# EasyEDA Pro project EasyEDA_MEMS_FPC_V12.epro

# Schematic Schematic1
Assembly Variant: Basic; Board Name: Board1; Create Date: 2026-06-03; Page Name: P1; Project Name: ProDoc_Board1_2026-06-03; Schematic Name: Schematic1; Update Date: 2026-06-04; Company: 嘉立创EDA; Page Size: A4; Version: V1.0
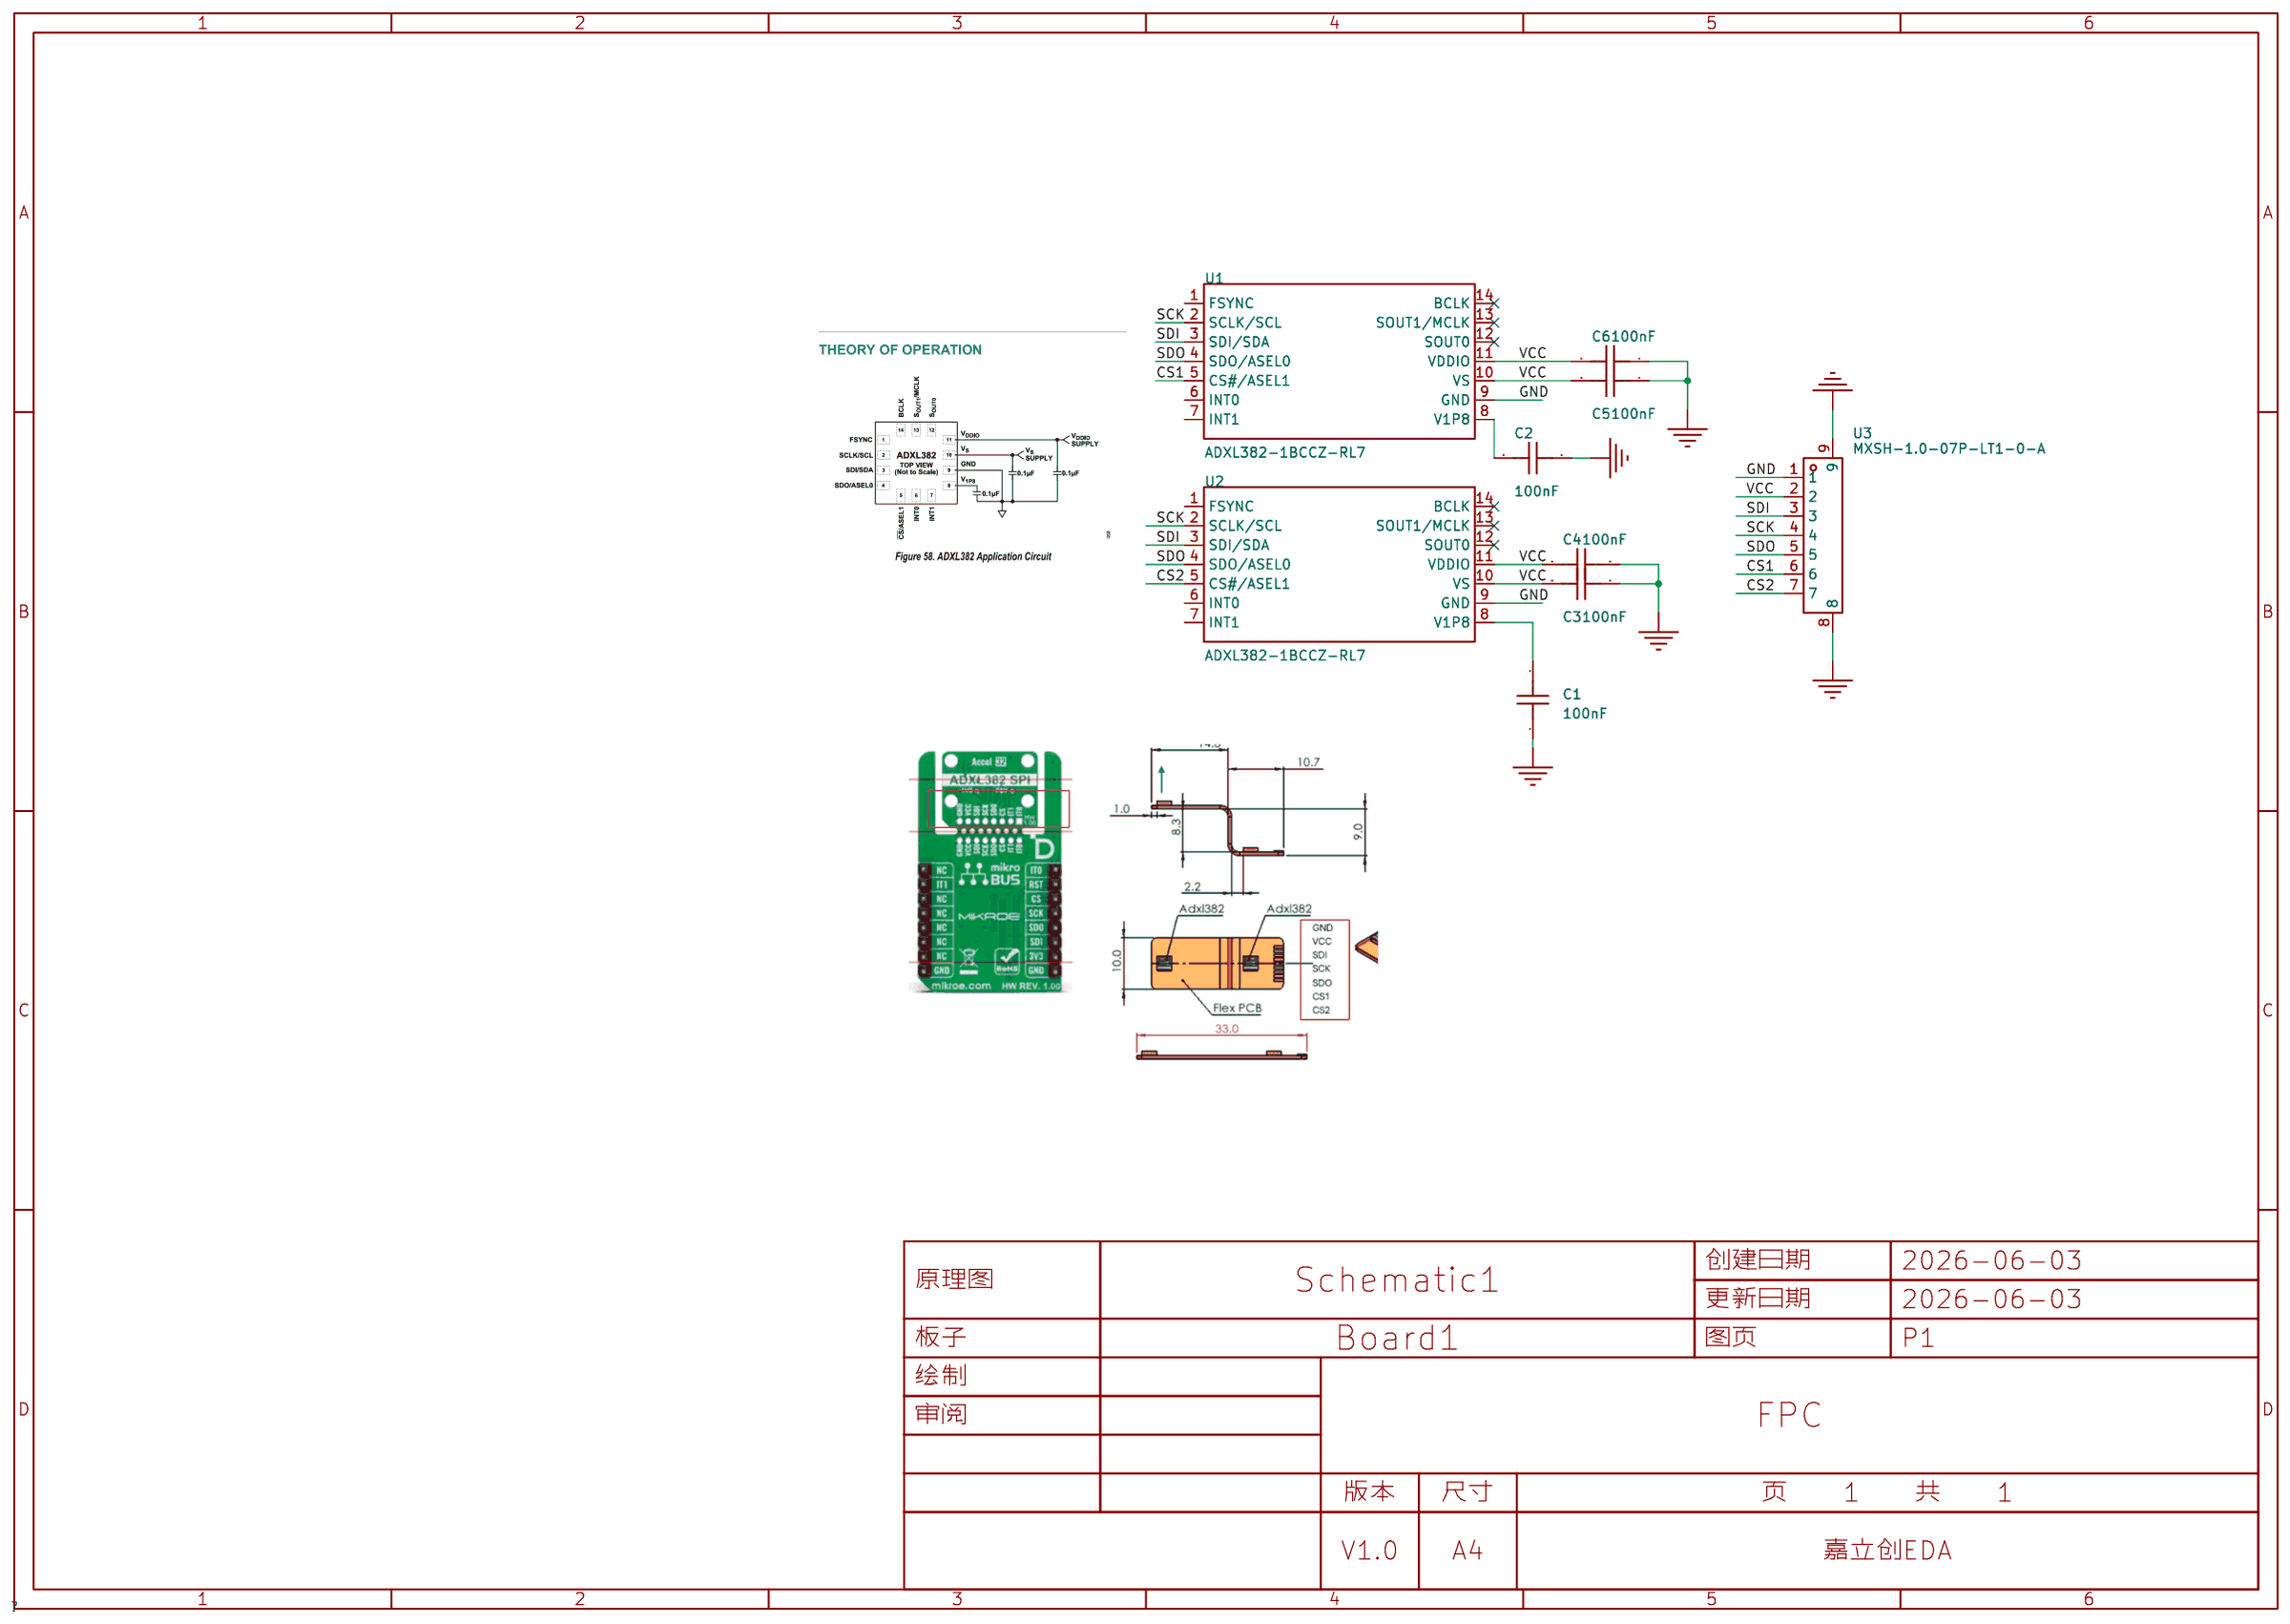
[diagram p0: schematic sheet]

## Parts
C1  100nF  [C0402]
C2  100nF  [C0402]
C3  100nF  [C0402]
C4  100nF  [C0402]
C5  100nF  [C0402]
C6  100nF  [C0402]
U1  ADXL382-1BCCZ-RL7  [LGA-14_L2.9-W2.8-P0.50-TL_CC-14-3]
U2  ADXL382-1BCCZ-RL7  [LGA-14_L2.9-W2.8-P0.50-TL_CC-14-3]
U3  MXSH-1.0-07P-LT1-0-A  [CONN-SMD_7P-P1.00_MAX_MXSH-1.0-07P-LT1-0-A]

## Library data of the parts
C1-C6 = CL05B104KO5NNNC: LCSC Part Name: 100nF ±10% 16V; Supplier Part: C1525; Manufacturer: SAMSUNG(三星); Supplier Footprint: 0402; JLCPCB Part Class: Basic Part; Datasheet: https://item.szlcsc.com/datasheet/CL05B104KO5NNNC/1877.html; Supplier: LCSC; Tolerance: ±10%; Voltage Rating: 16V; Temperature Coefficient: X7R
U1 U2 = ADXL382-1BCCZ-RL7_C41718413: LCSC Part Name: 低噪声、低功耗、宽带宽三轴MEMS加速度计，具备多协议接口和系统级节能特性; Supplier Part: C41718413; Manufacturer: ADI(亚德诺); Supplier Footprint: LGA-14; JLCPCB Part Class: Extended Part; Datasheet: https://item.szlcsc.com/datasheet/ADXL382-1BCCZ-RL7/43588120.html; Supplier: LCSC; Accelerometer Sensing Axis: X,Y,Z; Acceleration Measurement Range (MAX): ±60g; Sensor Type: 加速度计; Output Bits: 16bit; Interface: SPI; Voltage - Supply: 2.25V~3.6V; Cache Size: 0.64KB; Standby Current: 6.8uA; Operating Temperature: -40℃~+125℃; Features: 运动事件检测；过量程保护功能
U3 = MXSH-1.0-07P-LT1-0-A: LCSC Part Name: 1x7P 间距:1mm 立贴 系列:SH; Supplier Part: C19185719; Manufacturer: MAX(迈旭); Supplier Footprint: SMD,P=1mm; JLCPCB Part Class: Extended Part; Datasheet: https://item.szlcsc.com/datasheet/MXSH-1.0-07P-LT1-0-A/20402428.html; Supplier: LCSC; Pins Structure: 1x7P; Pitch: 1mm; Mounting Type: 立贴; Reference Series: SH; Number of Pins: 7P; Number of Rows: 1; Number of PINs Per Row: 7; Contact Plating: 锡; Operating Temperature: -25℃~+85℃; Voltage Rating: 150V; Plastic Material: LCP; Flame Retardant Rating: UL94V-0

## Nets
GND: C1.1 C2.1 C3.1 C4.1 C5.1 C6.1 U1.9(GND) U2.9(GND) U3.1 U3.8 U3.9
VCC: C3.2 C4.2 C5.2 C6.2 U1.10(VS) U1.11(VDDIO) U2.10(VS) U2.11(VDDIO) U3.2
CS1: U1.5(CS#/ASEL1) U3.6
CS2: U2.5(CS#/ASEL1) U3.7
SCK: U1.2(SCLK/SCL) U2.2(SCLK/SCL) U3.4
SDI: U1.3(SDI/SDA) U2.3(SDI/SDA) U3.3
SDO: U1.4(SDO/ASEL0) U2.4(SDO/ASEL0) U3.5
$1N26: C2.2 U1.8(V1P8)
$1N27: C1.2 U2.8(V1P8)

Not connected (* = marked no-connect by the designer): U1 1(FSYNC) 6(INT0) 7(INT1) 12(SOUT0)* 13(SOUT1/MCLK)* 14(BCLK)*; U2 1(FSYNC) 6(INT0) 7(INT1) 12(SOUT0)* 13(SOUT1/MCLK)* 14(BCLK)*

# Board PCB1
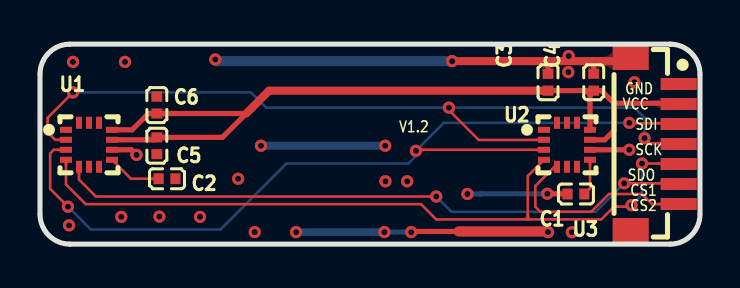
[diagram p1: board, top side]
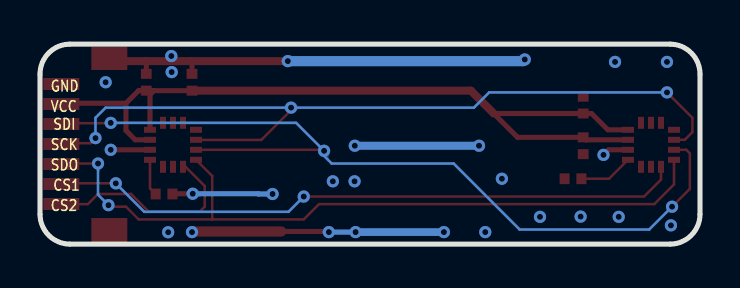
[diagram p2: board, bottom side, seen from below]

Outline 33 x 10 mm; copper layers: Top Layer, Bottom Layer. Coordinates in mm from the lower left corner of the outline.
Outline path: 0,8.5 0,1.5 arc(0.44,0.44) 1.5,0 31.5,0 arc(32.56,0.44) 33,1.5 33,8.5 arc(32.56,9.56) 31.5,10 1.5,10 arc(0.44,9.56) 0,8.5
Stack: Top Layer 0.012mm / Dielectric1 0.025mm FR4 er 4.5 / Bottom Layer 0.012mm

## Design rules (mm)
spacing copperThickness1oz (default): track to track 0.102, other pairs 0.076 to 0.3
spacing copperThickness2oz: track to track 0.203, other pairs 0.152 to 0.3
spacing Plane_innerPlane: track to track 0.102, other pairs 0.076 to 0.3
spacing Copper_copperRegion: track to track 0.102, other pairs 0.076 to 0.3
track width copperThickness1oz (default): min 0.127, default 0.254, max 2.54
track width copperThickness2oz: min 0.203, default 0.254, max 2.54
differential pair differentialPair (default): width min 0.127, default 0.254, max 2.54; gap min 0.152, default 0.152
via viaSize (default): diameter min 0.4, default 0.4, max 10; hole min 0.3, default 0.3, max 6.3
pour e155 uses Copper_copperRegion
pour e160 uses Copper_copperRegion
pour e194 uses Copper_copperRegion

## Placement (name value [footprint] x y rotation side)
C1  100nF  [C0402]  26.8 2.51 0 top
C2  100nF  [C0402]  6.35 3.27 180 top
C3  100nF  [C0402]  25.4 8.09 270 top
C4  100nF  [C0402]  27.69 8.09 270 top
C5  100nF  [C0402]  5.84 4.92 90 top
C6  100nF  [C0402]  5.84 6.95 270 top
U1  ADXL382-1BCCZ-RL7  [LGA-14_L2.9-W2.8-P0.50-TL_CC-14-3]  2.45 4.97 0 top
U2  ADXL382-1BCCZ-RL7  [LGA-14_L2.9-W2.8-P0.50-TL_CC-14-3]  26.35 4.97 0 top
U3  MXSH-1.0-07P-LT1-0-A  [CONN-SMD_7P-P1.00_MAX_MXSH-1.0-07P-LT1-0-A]  30.73 5.01 270 top

## Footprints (pads in the part's own frame, mm; a bottom-side part is the same pattern mirrored in y, then rotated)
C0402
  rect 0.5x0.54 smd: 1(-0.42,0) 2(0.42,0)
CONN-SMD_7P-P1.00_MAX_MXSH-1.0-07P-LT1-0-A
  rect 0.6x1.8 smd: 1(-3,1.2) 2(-2,1.2) 3(-1,1.2) 4(0,1.2) 5(1,1.2) 6(2,1.2) 7(3,1.2)
  rect 1.2x1.8 smd: 8(4.3,-1.2) 9(-4.3,-1.2)
LGA-14_L2.9-W2.8-P0.50-TL_CC-14-3
  rect 0.6x0.3 smd: 1(-1.15,0.75) 2(-1.15,0.25) 3(-1.15,-0.25) 4(-1.15,-0.75) 8(1.15,-0.75) 9(1.15,-0.25) 10(1.15,0.25) 11(1.15,0.75)
  rect 0.3x0.6 smd: 5(-0.5,-1.1) 6(0,-1.1) 7(0.5,-1.1) 12(0.5,1.1) 13(0,1.1) 14(-0.5,1.1)

## Nets
As in the schematic.

Pads without a net: U1 1 6 7 12 13 14; U2 1 6 7 12 13 14

## Via types
v1: diameter 0.61, hole 0.305, Top Layer to Bottom Layer, 36 vias

## Routing (per net, layer and track width the routed paths; a pad name or vN(x,y) marks a point on that pad's centre or on a via; arc(x,y) is an arc through that point)
GND: length 49.3
  Top Layer w0.254: v1(25.36,2.52) 26.36,2.52 C1.1 ; 27.69,9.15 27.69,9.15 C4.1 ; 25.44,9.15 25.4,9.11 C3.1 ; v1(4.83,4.46) 4.57,4.72 U1.9 ; v1(18.56,0.6) 18.59,0.63 20.94,0.63 ; U2.9 v1(29.46,4.72)
  Top Layer w0.4: U3.9 29.38,9.15 v1(20.61,9.15)
  Top Layer w0.508: v1(25.4,0.6) 25.37,0.63 20.94,0.63
  Bottom Layer w0.254: v1(21.37,2.51) 22.07,2.51 22.09,2.52 v1(25.36,2.52) ; v1(17.22,0.6) v1(18.56,0.6)
  Bottom Layer w0.381: 12.83,0.6 v1(17.22,0.6)
  Bottom Layer w0.4: v1(11.05,4.92) v1(17.26,4.92)
  Bottom Layer w0.508: v1(20.61,9.15) 8.85,9.15 v1(8.76,9.23)
  vias: v1(1.45,0.94) v1(1.65,9.11) v1(4.06,1.36) v1(4.25,9.11) v1(5.97,1.38) v1(8,1.36) v1(9.91,3.27) v1(10.74,0.6) v1(12.81,0.6) v1(17.27,3.14) v1(18.36,3.14) v1(26.44,9.41) v1(26.42,8.6) v1(26.59,0.59) v1(29.72,8.09)
VCC: length 42.1
  Top Layer w0.254: 27.31,7.67 27.5,7.48 U2.11 ; 27.31,7.67 C3.2 ; 27.31,7.67 C4.2 28.07,7.67 28.7,7.04 ; U2.10 28.24,5.22 28.7,5.68 28.7,7.04 ; 28.7,7.04 32.58,7.04 ; U1.11 4.61,5.72 5.42,6.53 C6.2 10.31,6.53 9.12,5.34 C5.2 5.72,5.22 U1.10
  Top Layer w0.4: 10.31,6.53 11.46,7.67 C3.2
CS1: length 31.9
  Top Layer w0.127: U1.5 1.95,3.22 2.79,2.38 v1(19.81,2.38) ; 31.93,2.92 31.87,2.92 31.75,3.04 v1(29.21,3.04)
  Bottom Layer w0.127: v1(29.21,3.04) 27.79,1.62 20.57,1.62 v1(19.81,2.38)
CS2: length 10.4
  Top Layer w0.127: U2.5 25.72,3.87 24.76,2.91 24.76,1.87 25.02,1.62 27.56,1.62 28.45,2.51 30.1,2.51 30.61,2 31.76,2 31.81,2.05 31.93,2.05
SCK: length 41
  Top Layer w0.127: v1(30.23,5.3) 30.48,5.05 31.93,5.05 ; v1(20.45,6.83) 20.45,6.7 21.94,5.21 25.07,5.21 25.07,5.22 U2.2 ; v1(1.65,7.59) 0.38,6.32 0.38,5.6 0.76,5.22 U1.2
  Bottom Layer w0.127: v1(1.65,7.59) 10.54,7.59 11.3,6.83 v1(20.45,6.83) 29.72,6.83 30.23,6.32 v1(30.23,5.3)
SDI: length 43.7
  Top Layer w0.127: U2.3 18.85,4.72 v1(18.8,4.67) ; v1(1.4,1.87) 0.51,2.76 0.51,4.54 0.69,4.72 1.3,4.72 ; v1(29.46,6.06) 29.48,6.05 31.93,6.05
  Bottom Layer w0.127: v1(29.46,6.06) 20.19,6.06 v1(18.8,4.67) 18.8,4.41 18.41,4.03 12.32,4.03 9.02,0.73 2.54,0.73 v1(1.4,1.87)
SDO: length 38
  Top Layer w0.127: 24.39,1.24 28.07,1.24 28.7,1.87 29.5,1.87 v1(29.58,1.95) ; 24.39,1.24 24.39,3.41 U2.4 ; 24.39,1.24 19.81,1.24 19.05,2 2.29,2 1.3,2.98 U1.4 ; 31.93,4.05 31.92,4.03 v1(30.1,4.03)
  Bottom Layer w0.127: v1(29.58,1.95) 30.1,2.47 v1(30.1,4.03)
$1N26: length 2.7
  Top Layer w0.127: C2.2 4.55,3.27 U1.8
$1N27: length 1.8
  Top Layer w0.127: C1.2 27.5,2.79 U2.8

## Copper pours and planes (outline as drawn; the poured copper is in the pictures)
GND on Top Layer: 14.73,9.87 22.39,9.87 22.39,0.13 14.73,0.13
GND on Top Layer: 0.38,8.25 0.39,8.43 0.44,8.67 0.53,8.9 0.66,9.12 0.82,9.31 1.01,9.47 1.22,9.59 1.45,9.68 1.7,9.73 1.88,9.75 31.14,9.75 31.32,9.73 31.57,9.68 31.8,9.59 32.01,9.47 32.2,9.31 32.36,9.12 32.49,8.9 32.58,8.67 32.63,8.43 32.64,8.25 32.64,1.72 32.63,1.54 32.58,1.29 32.49,1.06 32.36,0.85 32.2,0.66 32.01,0.5 31.8,0.37 31.57,0.28 31.32,0.23 31.14,0.22 1.88,0.22 1.7,0.23 1.45,0.28 1.22,0.37 1.01,0.5 0.82,0.66 0.66,0.85 0.53,1.06 0.44,1.29 0.39,1.54 0.38,1.72
GND on Bottom Layer: 0.38,8.25 0.39,8.43 0.44,8.67 0.53,8.9 0.66,9.12 0.82,9.31 1.01,9.47 1.22,9.59 1.45,9.68 1.7,9.73 1.88,9.75 31.27,9.75 31.45,9.73 31.69,9.68 31.92,9.59 32.14,9.47 32.33,9.31 32.49,9.12 32.61,8.9 32.7,8.67 32.75,8.43 32.77,8.25 32.77,1.72 32.75,1.54 32.7,1.29 32.61,1.06 32.49,0.85 32.33,0.66 32.14,0.5 31.92,0.37 31.69,0.28 31.45,0.23 31.27,0.22 1.88,0.22 1.7,0.23 1.45,0.28 1.22,0.37 1.01,0.5 0.82,0.66 0.66,0.85 0.53,1.06 0.44,1.29 0.39,1.54 0.38,1.72

Small or netless copper shapes (teardrops, artwork), in the pictures only: 49 on Top Layer, 16 on Bottom Layer

## Text on the board
Bottom Silkscreen Layer: SDI | CS1 | GND | VCC | SCK | SDO | CS2
Top Silkscreen Layer: V1.2 | VCC | GND | SDO | CS1 | CS2 | SDI | SCK
